# EAGLE design Spirit (EAGLE 9.4.2)
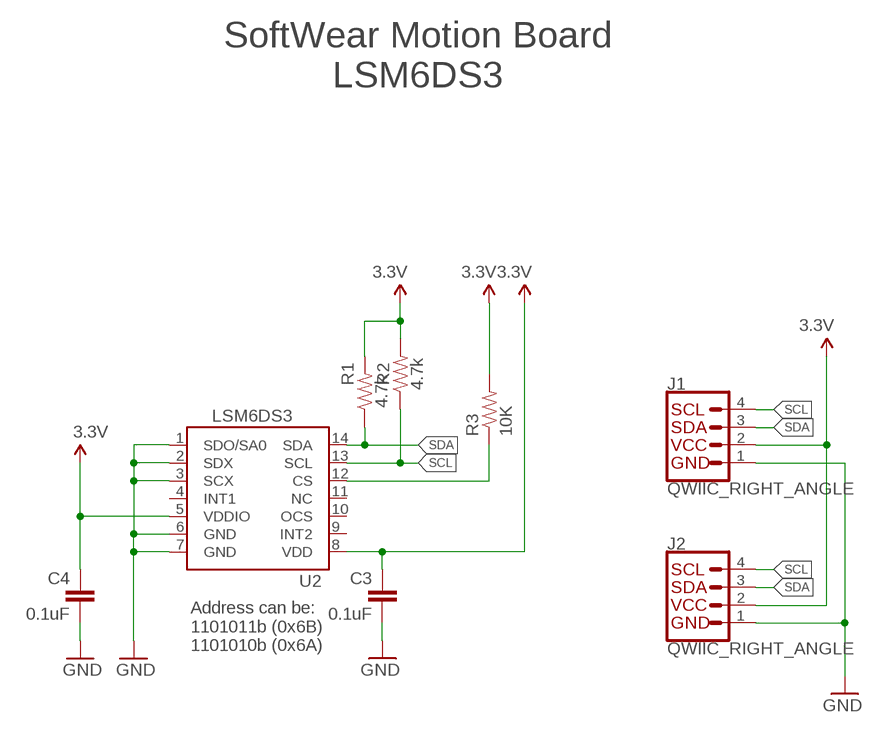
[diagram p0: schematic, sheet 1]

## Parts
C3  0.1uF  0.1UF-100V-10%(0603)  [0603-CAP]
C4  0.1uF  0.1UF-100V-10%(0603)  [0603-CAP]
J1  QWIIC_RIGHT_ANGLE  QWIIC_CONNECTORJS-1MM  [JST04_1MM_RA]
J2  QWIIC_RIGHT_ANGLE  QWIIC_CONNECTORJS-1MM  [JST04_1MM_RA]
R1  4.7k  4.7KOHM-0603-1/10W-1%  [0603]
R2  4.7k  4.7KOHM-0603-1/10W-1%  [0603]
R3  10K  10KOHM-1/10W-1%(0603)0603  [0603-RES]
U2  LSM6DS3  LSM6DS3DOT_INDICATION  [LGA14L_DOT_INDICATOR]

## Nets
3.3V: C3.1 C4.1 J1.2 J2.2 R1.2 R2.2 R3.2 U2.5(VDDIO) U2.8(VDD)
CS: R3.1 U2.12(CS)
GND: C3.2 C4.2 J1.1 J2.1 U2.1(SDO/SA0) U2.2(SDX) U2.3(SCX) U2.6(GND) U2.7(GND)
SCL: J1.4 J2.4 R2.1 U2.13(SCL)
SDA: J1.3 J2.3 R1.1 U2.14(SDA)
Unconnected: U2.4(INT1) U2.9(INT2) U2.10(OCS) U2.11(NC)

## Notes on the sheet
- SoftWear Motion Board
  LSM6DS3
- Address can be:
  1101011b (0x6B)
  1101010b (0x6A)

## Library data of the parts
C3 C4 = SparkFun-Capacitors:0.1UF-100V-10%(0603): CAP-08390; PROD_ID: CAP-08390
J1 J2 = SparkFun-Connectors:QWIIC_CONNECTOR: SparkFun I2C Standard Qwiic Connector An SMD 1mm pitch JST connector makes it easy and quick (get it? Qwiic?) to connect I2C devices to each other. The Qwiic system <http://www.sparkfun.com/qwiic> enables fast and solderless connection between popular platforms and various sensors and actuators. We carry 200mm <https://www.sparkfun.com/products/14204>, 100mm <https://www.sparkfun.com/products/14205>, 50mm <https://www.sparkfun.com/products/14206>, and breadboard friendly <https://www.sparkfun.com/products/14207> Qwiic cables. We also offer 10 pcs strips <https://www.sparkfun.com/products/14323> the SMD connectors.; PROD_ID: CONN-13694
R1 R2 = SparkFun-Resistors:4.7KOHM: 4.7kΩ resistor A resistor is a passive two-terminal electrical component that implements electrical resistance as a circuit element. Resistors act to reduce current flow, and, at the same time, act to lower voltage levels within circuits. - Wikipedia; PROD_ID: RES-07857
R3 = SparkFun-Resistors:10KOHM-1/10W-1%(0603): RES-00824; PROD_ID: RES-00824
U2 = LSM6DS3:LSM6DS3; PROD_ID: IC-12969

## Board
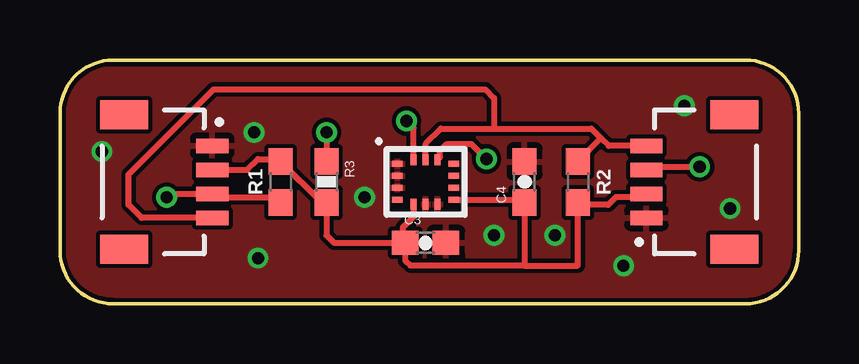
[diagram p1: board, top side]
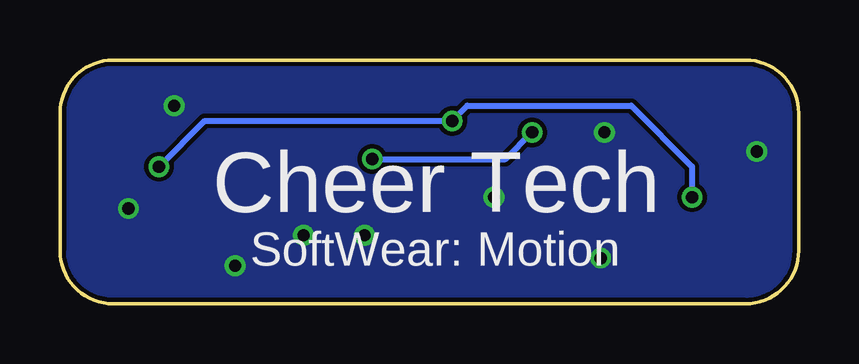
[diagram p2: board, bottom side, seen from below]

Size 30.8 x 10.16 mm. Coordinates in mm from the lower left corner, seen from the top.
Outline: 0,2.22 0,7.94 arc-90 2.22,10.16 28.57,10.16 arc-90 30.8,7.94 30.8,2.22 arc-90 28.57,0 2.22,0 arc-90 0,2.22
Copper layers (1*16): Top 0.035mm / dielectric 1.5mm / Bottom 0.035mm
Design rules "SparkFun-2-layer-TIGHT": minimum track width 7mil, minimum drill 15mil, track to track 7mil, track to pad 7mil, pad to pad 7mil, via to via 7mil, smd to smd 7mil, copper to edge 7mil, drill to drill 7mil, minimum pad ring 7mil, minimum via ring 7mil, stop-mask expansion 4mil, vias tented up to drill 25mil, thermal gap 10mil

### Footprints (pad centres in the part's own frame; a part is rotated, then mirrored left to right if it is on the bottom)
0603-CAP = smd 1.1 x 1: 1 -0.85,0; 2 0.85,0
JST04_1MM_RA = smd 0.6 x 1.35: 1 -1.5,0; 2 -0.5,0; 3 0.5,0; 4 1.5,0 | smd 1.2 x 2: NC1 2.8,-3.675; NC2 -2.8,-3.675
0603 = smd 1.1 x 1: 1 -0.85,0; 2 0.85,0
0603-RES = smd 1.1 x 1: 1 -0.85,0; 2 0.85,0
LGA14L_DOT_INDICATOR = smd 0.45 x 0.25: 1 -1.175,0.75; 2 -1.175,0.25; 3 -1.175,-0.25; 4 -1.175,-0.75; 8 1.175,-0.75; 9 1.175,-0.25; 10 1.175,0.25; 11 1.175,0.75 | smd 0.25 x 0.45: 5 -0.5,-0.925; 6 0,-0.925; 7 0.5,-0.925; 12 0.5,0.925; 13 0,0.925; 14 -0.5,0.925

### Placement (x,y rotation side)
C3  15.24,2.54 0 top
C4  19.37,5.08 90 top
J1  24.45,5.08 90 top
J2  6.35,5.08 270 top
R1  9.21,5.08 90 top
R2  21.59,5.08 270 top
R3  11.11,5.08 270 top
U2  15.24,5.08 0 top

### Tracks (layer width: path | path; a pad name or v marks a point on that pad's centre or on a via)
3.3V
  Top 0.254: J1.2 24.31,4.45 23.18,4.45 22.86,4.13 21.69,4.13 R2.2 21.59,1.59 19.37,1.59 | U2.8 19.27,4.33 C4.1 19.37,1.59 | U2.5 14.74,3.63 14.29,3.17 14.29,2.64 C3.1 | C3.1 14.39,1.8 14.61,1.59 19.37,1.59 | J2.2 7.8,5.58 8.26,6.03 9.11,6.03 R1.2 10.91,4.23 R3.2 11.11,2.86 11.43,2.54 C3.1
CS  (via drill 0.51)
  Top 0.254: U2.12 15.85,6.12 15.85,6.38 16.14,6.67 17.14,6.67 v17.78,6.03 | v11.11,7.14 R3.1
  Bottom 0.254: v17.78,6.03 12.22,6.03 v11.11,7.14
GND  (via drill 0.51)
  other vias: 12.7,4.45 8.26,1.91 26.04,8.26 23.5,1.59 20.64,2.86 18.1,2.86 8.1,7.14 1.75,6.35 27.94,3.97
  pour Top: 0,0 0,10.16 30.48,10.16 arc-90 30.8,9.84 30.8,0
  pour Bottom: 0,0 0,10.16 30.8,10.16 30.8,0
SCL
  Top 0.254: J1.4 22.88,6.58 22.56,6.9 | 22.56,6.9 R2.1 | U2.13 15.24,6.67 15.88,7.3 18.1,7.3 | 18.1,7.3 22.15,7.3 22.56,6.9 | J2.4 3.4,3.58 2.86,4.13 2.86,5.4 6.4,8.94 17.73,8.94 18.1,8.57 18.1,7.3
SDA  (via drill 0.51)
  Top 0.254: R1.1 8.99,4.45 6.49,4.45 J2.3 4.58,4.58 v4.45,4.45 | J1.3 24.58,5.71 v26.67,5.71 | U2.14 14.74,7.33 v14.45,7.62
  Bottom 0.254: v26.67,5.71 24.77,7.62 v14.45,7.62 13.81,8.26 6.99,8.26 4.45,5.71 v4.45,4.45

### Text on the board
bPlace: Cheer Tech | SoftWear: Motion